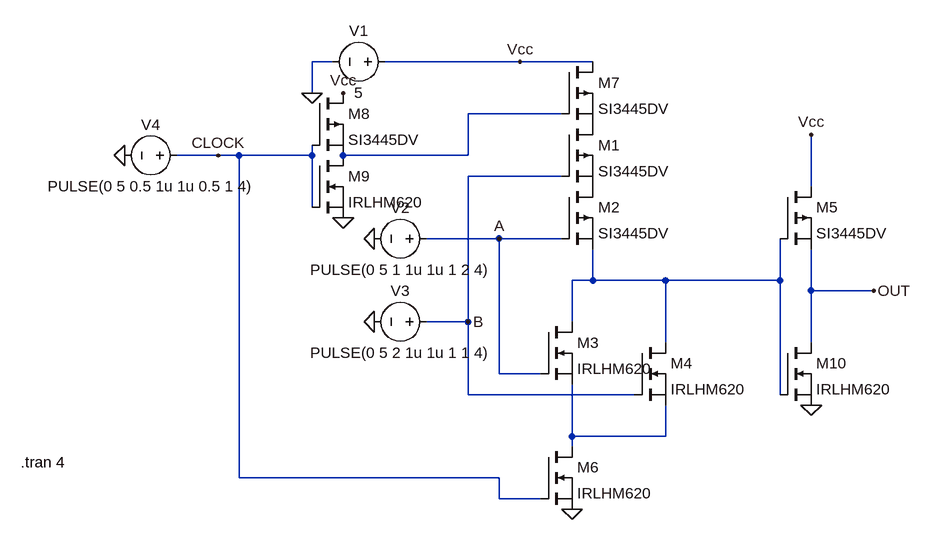
[diagram p0: schematic OR C2.asc]
OR C2.asc, the LTspice schematic file:
Version 4.1
SHEET 1 880 708
WIRE -144 -128 -176 -128
WIRE 144 -128 -64 -128
WIRE 256 -128 144 -128
WIRE -176 -80 -176 -128
WIRE 208 -48 64 -48
WIRE -320 16 -384 16
WIRE -288 16 -320 16
WIRE -176 16 -176 0
WIRE -176 16 -288 16
WIRE 64 16 64 -48
WIRE 64 16 -128 16
WIRE 208 48 64 48
WIRE 592 64 592 -16
WIRE -176 96 -176 16
WIRE 112 144 0 144
WIRE 208 144 112 144
WIRE 256 208 256 160
WIRE 256 208 224 208
WIRE 368 208 256 208
WIRE 544 208 544 144
WIRE 544 208 368 208
WIRE 592 224 592 160
WIRE 688 224 592 224
WIRE 64 272 64 48
WIRE 64 272 0 272
WIRE 224 272 224 208
WIRE 368 304 368 208
WIRE 592 304 592 224
WIRE 112 352 112 144
WIRE 176 352 112 352
WIRE 64 384 64 272
WIRE 320 384 64 384
WIRE 544 384 544 208
WIRE 224 448 224 368
WIRE 368 448 368 400
WIRE 368 448 224 448
WIRE 224 464 224 448
WIRE -288 512 -288 16
WIRE 112 512 -288 512
WIRE 112 544 112 512
WIRE 176 544 112 544
FLAG -176 -80 0
FLAG 144 -128 Vcc
FLAG -80 144 0
FLAG -80 272 0
FLAG 112 144 A
FLAG 64 272 B
FLAG 592 400 0
FLAG 688 224 OUT
FLAG -464 16 0
FLAG -320 16 CLOCK
FLAG 224 560 0
FLAG 592 -16 Vcc
FLAG -128 -80 Vcc
FLAG -128 112 0
SYMBOL voltage -48 -128 R90
WINDOW 0 -32 56 VBottom 2
WINDOW 3 32 56 VTop 2
WINDOW 123 0 0 Left 0
WINDOW 39 0 0 Left 0
SYMATTR InstName V1
SYMATTR Value 5
SYMBOL nmos 176 272 R0
SYMATTR InstName M3
SYMATTR Value IRLHM620
SYMBOL voltage 16 144 R90
WINDOW 0 -32 56 VBottom 2
WINDOW 3 32 56 VTop 2
WINDOW 123 0 0 Left 0
WINDOW 39 0 0 Left 0
SYMATTR InstName V2
SYMATTR Value PULSE(0 5 1 1u 1u 1 2 4)
SYMBOL voltage 16 272 R90
WINDOW 0 -32 56 VBottom 2
WINDOW 3 32 56 VTop 2
WINDOW 123 0 0 Left 0
WINDOW 39 0 0 Left 0
SYMATTR InstName V3
SYMATTR Value PULSE(0 5 2 1u 1u 1 1 4)
SYMBOL voltage -368 16 R90
WINDOW 0 -32 56 VBottom 2
WINDOW 3 32 56 VTop 2
WINDOW 123 0 0 Left 0
WINDOW 39 0 0 Left 0
SYMATTR InstName V4
SYMATTR Value PULSE(0 5 0.5 1u 1u 0.5 1 4)
SYMBOL pmos 544 64 R0
SYMATTR InstName M5
SYMATTR Value SI3445DV
SYMBOL nmos 176 464 R0
SYMATTR InstName M6
SYMATTR Value IRLHM620
SYMBOL nmos 544 304 R0
SYMATTR InstName M10
SYMATTR Value IRLHM620
SYMBOL pmos -176 -80 R0
SYMATTR InstName M8
SYMATTR Value SI3445DV
SYMBOL nmos -176 16 R0
SYMATTR InstName M9
SYMATTR Value IRLHM620
SYMBOL pmos 208 -128 R0
SYMATTR InstName M7
SYMATTR Value SI3445DV
SYMBOL pmos 208 -32 R0
SYMATTR InstName M1
SYMATTR Value SI3445DV
SYMBOL pmos 208 64 R0
SYMATTR InstName M2
SYMATTR Value SI3445DV
SYMBOL nmos 320 304 R0
SYMATTR InstName M4
SYMATTR Value IRLHM620
TEXT -624 488 Left 2 !.tran 4

The netlist it stands for:
* OR C2.asc
V1 Vcc 0 5
M3 N002 A N003 N003 IRLHM620
V2 A 0 PULSE(0 5 1 1u 1u 1 2 4)
V3 B 0 PULSE(0 5 2 1u 1u 1 1 4)
V4 CLOCK 0 PULSE(0 5 0.5 1u 1u 0.5 1 4)
M5 Vcc N002 OUT OUT SI3445DV
M6 N003 CLOCK 0 0 IRLHM620
M10 OUT N002 0 0 IRLHM620
M8 Vcc CLOCK N001 N001 SI3445DV
M9 N001 CLOCK 0 0 IRLHM620
M7 Vcc N001 P001 P001 SI3445DV
M1 P001 B P002 P002 SI3445DV
M2 P002 A N002 N002 SI3445DV
M4 N002 B N003 N003 IRLHM620
.model NMOS NMOS
.model PMOS PMOS
.lib standard.mos
.tran 4
.backanno
.end